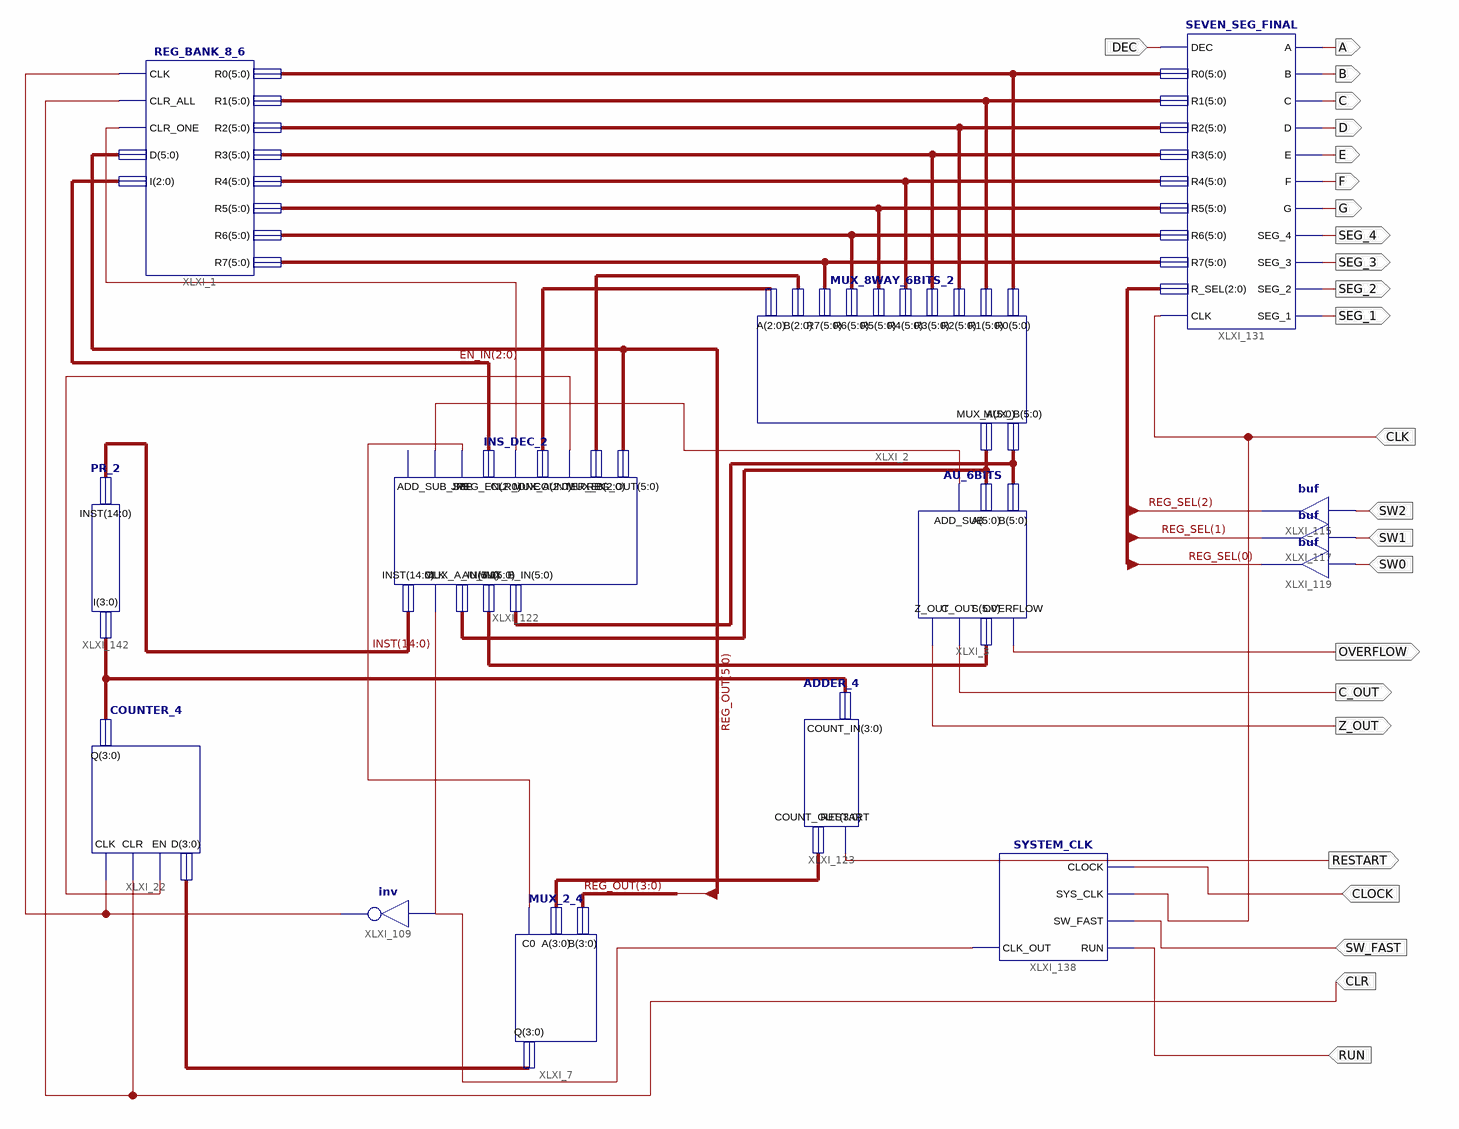
[diagram p0: schematic sheet 1]
// Xilinx ISE schematic PROCESSOR_6BITS.sch (spartan3e) as structural Verilog: 14 symbols, 24 ports
module PROCESSOR_6BITS (
  input  CLR,
  input  CLK,
  input  SW2,
  input  SW1,
  input  SW0,
  input  DEC,
  input  CLOCK,
  input  SW_FAST,
  input  RUN,
  output RESTART,
  output C_OUT,
  output OVERFLOW,
  output Z_OUT,
  output A,
  output B,
  output C,
  output D,
  output E,
  output F,
  output G,
  output SEG_1,
  output SEG_2,
  output SEG_3,
  output SEG_4
);

  wire CLOCK_PR, XLXN_44, XLXN_48, XLXN_167, XLXN_280, XLXN_298;
  wire [2:0] EN_IN, REG_SEL, XLXN_45, XLXN_46;
  wire [3:0] COUNT, XLXN_110, XLXN_124;
  wire [5:0] R0, R1, R2, R3, R4, R5, R6, R7, REG_OUT, XLXN_41, XLXN_56, XLXN_58;
  wire [14:0] INST;

  REG_BANK_8_6 XLXI_1 (
    .CLK(XLXN_298), .CLR_ALL(CLR), .CLR_ONE(XLXN_44), .D(REG_OUT), .I(EN_IN), .R0(R0), .R1(R1), .R2(R2),
    .R3(R3), .R4(R4), .R5(R5), .R6(R6), .R7(R7));
  MUX_8WAY_6BITS_2 XLXI_2 (
    .R7(R7), .R0(R0), .R1(R1), .R2(R2), .R3(R3), .R4(R4), .R5(R5), .R6(R6), .B(XLXN_46), .A(XLXN_45),
    .MUX_B(XLXN_58), .MUX_A(XLXN_56));
  AU_6BITS XLXI_3 (
    .A(XLXN_56), .ADD_SUB(XLXN_48), .B(XLXN_58), .C_OUT(C_OUT), .OVERFLOW(OVERFLOW), .S(XLXN_41),
    .Z_OUT(Z_OUT));
  MUX_2_4 XLXI_7 (.A(XLXN_110), .B(REG_OUT[3:0]), .C0(XLXN_167), .Q(XLXN_124));
  COUNTER_4 XLXI_22 (.CLK(XLXN_298), .CLR(CLR), .D(XLXN_124), .EN(XLXN_280), .Q(COUNT));
  not XLXI_109 (XLXN_298, CLOCK_PR);
  INS_DEC_2 XLXI_122 (
    .ADD_SUB_SEL(XLXN_48), .AU_IN(XLXN_41), .CLK(CLOCK_PR), .CLR_ONE(XLXN_44), .COUNTER_EN(XLXN_280),
    .INST(INST), .JMP(XLXN_167), .MUX_A(XLXN_45), .MUX_A_IN(XLXN_56), .MUX_B(XLXN_46), .MUX_B_IN(XLXN_58),
    .REG_EN(EN_IN), .REG_OUT(REG_OUT));  // open: ADD_FLAG
  ADDER_4 XLXI_123 (.COUNT_IN(COUNT), .COUNT_OUT(XLXN_110), .RESTART(RESTART));
  buf XLXI_115 (REG_SEL[2], SW2);
  buf XLXI_117 (REG_SEL[1], SW1);
  buf XLXI_119 (REG_SEL[0], SW0);
  SEVEN_SEG_FINAL XLXI_131 (
    .A(A), .B(B), .C(C), .CLK(CLK), .D(D), .DEC(DEC), .E(E), .F(F), .G(G), .R0(R0), .R1(R1), .R2(R2),
    .R3(R3), .R4(R4), .R5(R5), .R6(R6), .R7(R7), .R_SEL(REG_SEL), .SEG_1(SEG_1), .SEG_2(SEG_2),
    .SEG_3(SEG_3), .SEG_4(SEG_4));
  SYSTEM_CLK XLXI_138 (.CLK_OUT(CLOCK_PR), .CLOCK(CLOCK), .RUN(RUN), .SW_FAST(SW_FAST), .SYS_CLK(CLK));
  PR_2 XLXI_142 (.I(COUNT), .INST(INST));
endmodule
